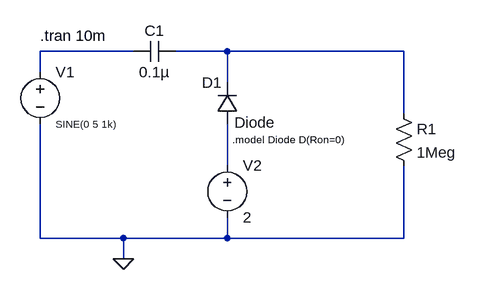
[diagram p0: schematic Clamper.asc]
Clamper.asc, the LTspice schematic file:
Version 4
SHEET 1 880 680
WIRE 48 96 -96 96
WIRE 192 96 112 96
WIRE 464 96 192 96
WIRE -96 128 -96 96
WIRE 192 144 192 96
WIRE 464 192 464 96
WIRE 192 272 192 208
WIRE -96 384 -96 208
WIRE 32 384 -96 384
WIRE 192 384 192 352
WIRE 192 384 32 384
WIRE 464 384 464 272
WIRE 464 384 192 384
WIRE 32 416 32 384
FLAG 32 416 0
SYMBOL diode 208 208 R180
WINDOW 0 24 64 Left 2
WINDOW 3 -58 2 Left 2
SYMATTR InstName D1
SYMATTR Value Diode
SYMBOL cap 112 80 R90
WINDOW 0 0 32 VBottom 2
WINDOW 3 32 32 VTop 2
SYMATTR InstName C1
SYMATTR Value 0.1µ
SYMBOL voltage -96 112 R0
WINDOW 3 24 96 Left 1
WINDOW 123 0 0 Left 0
WINDOW 39 0 0 Left 0
SYMATTR InstName V1
SYMATTR Value SINE(0 5 1k)
SYMBOL voltage 192 256 R0
WINDOW 123 0 0 Left 0
WINDOW 39 0 0 Left 0
SYMATTR InstName V2
SYMATTR Value 2
SYMBOL res 448 176 R0
SYMATTR InstName R1
SYMATTR Value 1Meg
TEXT -96 72 Left 2 !.tran 10m
TEXT 200 232 Left 1 !.model Diode D(Ron=0)

The netlist it stands for:
* Clamper.asc
D1 N003 N002 Diode
C1 N002 N001 0.1µ
V1 N001 0 SINE(0 5 1k)
V2 N003 0 2
R1 N002 0 1Meg
.model D D
.lib standard.dio
.tran 10m
.model Diode D(Ron=0)
.backanno
.end